# Altium schematic sheet BlackChat China Tx.SchDoc
size Letter
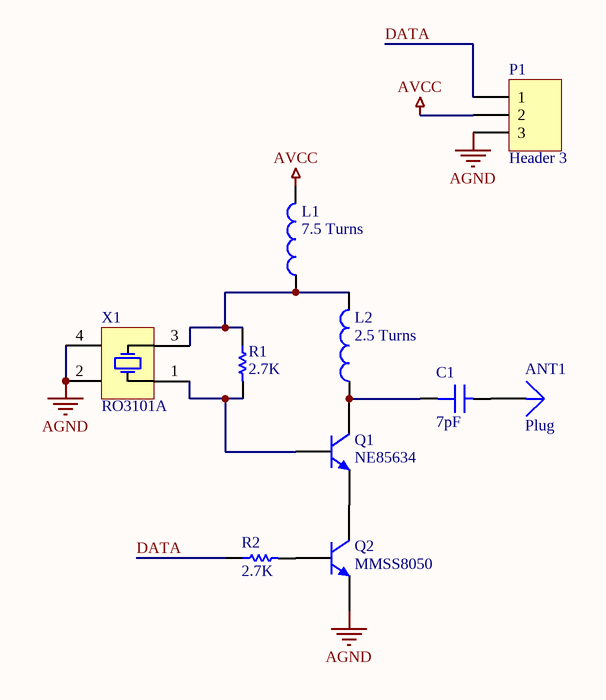
[diagram p0: BlackChat China Tx.SchDoc]

## Parts
ANT1  Plug  [PIN1]
C1  7pF  [CAP-0805]
L1  7.5 Turns  [AXIAL-0.4]
L2  2.5 Turns  [AXIAL-0.3]
P1  Header 3  [HDR1X3]
Q1  NE85634  [NE85634_SOT89]
Q2  MMSS8050  [SOT95P275X120-3N]
R1  2.7K  [RES-0805]
R2  2.7K  [RES-0805]
X1  RO3101A  [RO3101A]

## Nets
AGND: P1.3 Q2.1(E) X1.2(CASE) X1.4(CASE)
AVCC: L1.2 P1.2
DATA: P1.1 R2.1
NetANT1_1: ANT1.1 C1.2
NetC1_1: C1.1 L2.1 Q1.2(C)
NetL1_1: L1.1 L2.2 R1.1 X1.3(Terminal_2)
NetQ1_1: Q1.1(B) R1.2 X1.1(Terminal_1)
NetQ1_3: Q1.3(E) Q2.3(C)
NetQ2_2: Q2.2(B) R2.2

## Library data of the parts
C1 = CHIP-CAP: SMD Chip Capacitor; Value: 7pF
L1 L2 = Inductor: Generic Inductor
  L1: Value: 7.5 Turns
  L2: Value: 2.5 Turns
P1 = Header 3: Header, 3-Pin; LatestRevisionDate: 17-Jul-2002; LatestRevisionNote: Re-released for DXP Platform.; Publisher: Altium Limited
Q1 = NE85634: NPN RF SILICON TRANSISTOR
Q2 = MMSS8050: NPN SILICON TRANSISTOR
R1 R2 = CHIP-RES: SMD Chip Resistor; Value: 2.7K
X1 = RO3101A: 433.92 MHz  SAW  Resonator; ComponentLink1Description: Datasheet; ComponentLink1URL: http://www.mouser.com/catalog/specsheets/ro3101a1.pdf
ANT1 = Plug: LatestRevisionDate: 17-Jul-2002; LatestRevisionNote: Re-released for DXP Platform.; Publisher: Altium Limited